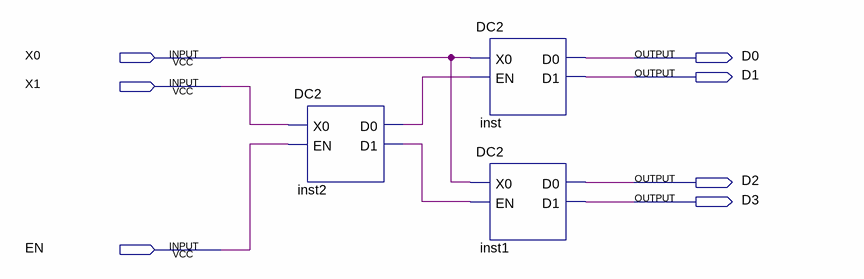
[diagram p0: schematic sheet]
// Quartus schematic DC4.bdf as structural Verilog: 3 symbols, 7 pins
module DC4 (
  input  X0,
  input  X1,
  input  EN,
  output D0,
  output D1,
  output D2,
  output D3
);

  wire inst2_d0, inst2_d1;

  DC2 inst2 (.X0(X1), .EN(EN), .D0(inst2_d0), .D1(inst2_d1));
  DC2 inst (.X0(X0), .EN(inst2_d0), .D0(D0), .D1(D1));
  DC2 inst1 (.X0(X0), .EN(inst2_d1), .D0(D2), .D1(D3));
endmodule
